# Altium schematic sheet Main PCB.SchDoc
size Legal
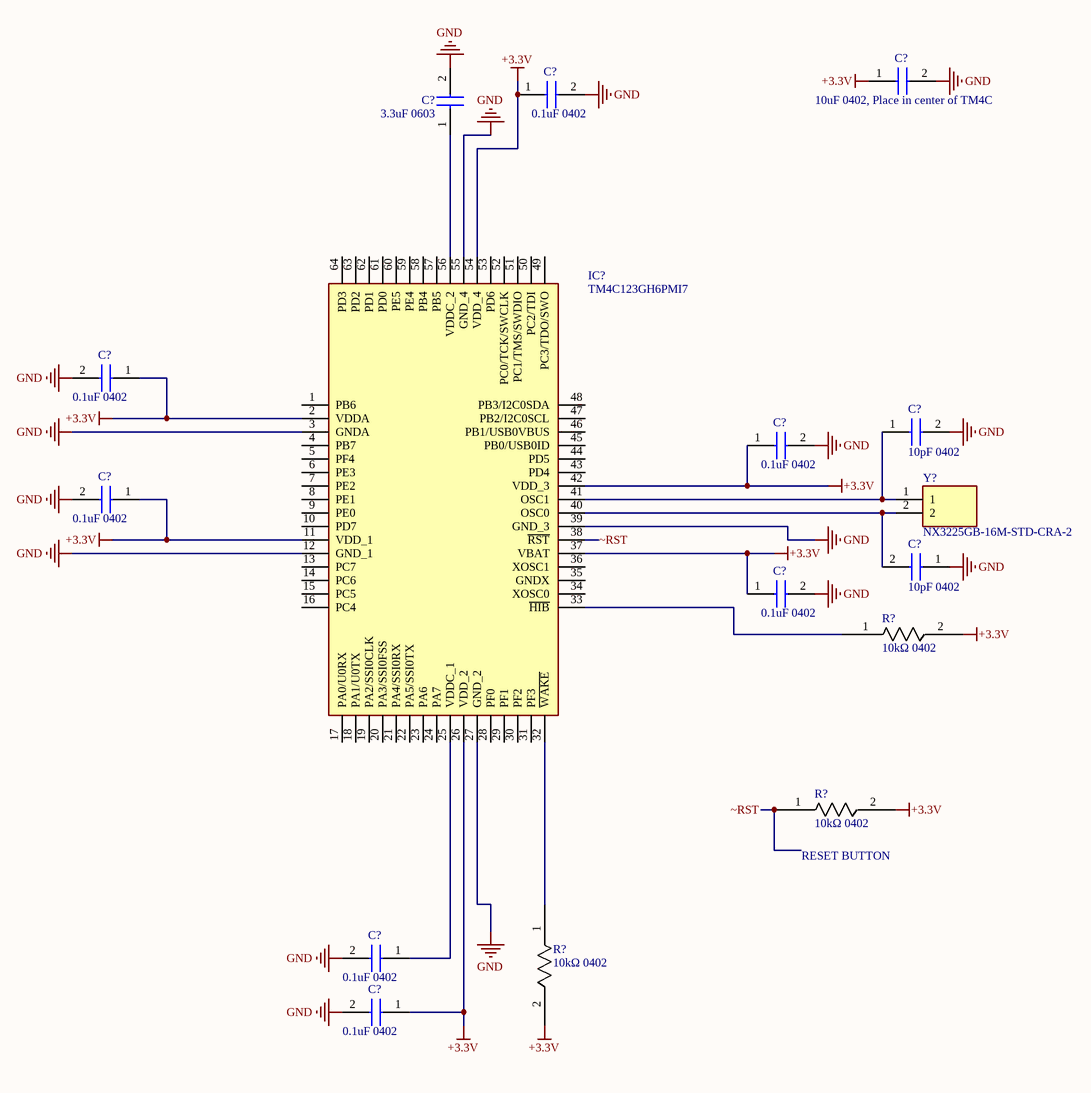
[diagram p0: Main PCB.SchDoc]

## Parts
(Parts that share a designator on the sheet are numbered #1, #2 ... from top to bottom, then left to right.)
C?#1  10uF 0402, Place in center of TM4C  [CAPC1005X56N]
C?#2  0.1uF 0402  [CAPC1005X56N]
C?#3  3.3uF 0603  [CAPC1005X56N]
C?#4  0.1uF 0402  [CAPC1005X56N]
C?#5  10pF 0402  [CAPC1005X56N]
C?#6  0.1uF 0402  [CAPC1005X56N]
C?#7  0.1uF 0402  [CAPC1005X56N]
C?#8  10pF 0402  [CAPC1005X56N]
C?#9  0.1uF 0402  [CAPC1005X56N]
C?#10  0.1uF 0402  [CAPC1005X56N]
C?#11  0.1uF 0402  [CAPC1005X56N]
IC?  TM4C123GH6PMI7  [QFP50P1200X1200X160-64N]
R?#1  10kΩ 0402  [0402]
R?#2  10kΩ 0402  [0402]
R?#3  10kΩ 0402  [0402]
Y?  NX3225GB-16M-STD-CRA-2  [NX3225GD-STD-CRA-3]

## Nets
+3.3V: C?#1.1 C?#2.1 C?#4.1 C?#6.1 C?#7.1 C?#9.1 C?#11.1 IC?.2(VDDA) IC?.11(VDD_1) IC?.26(VDD_2) IC?.37(VBAT) IC?.42(VDD_3) IC?.54(VDD_4)
GND: C?#1.2 C?#2.2 C?#3.2 C?#4.2 C?#5.2 C?#6.2 C?#7.2 C?#8.1 C?#9.2 C?#10.2 C?#11.2 IC?.3(GNDA) IC?.12(GND_1) IC?.27(GND_2) IC?.39(GND_3) IC?.55(GND_4)
~RST: IC?.38(~{RST}) R?#2.1
NetC?#3_1: C?#3.1 IC?.56(VDDC_2)
NetC?#5_1: C?#5.1 IC?.41(OSC1) Y?.1
NetC?#8_2: C?#8.2 IC?.40(OSC0) Y?.2
NetC?#10_1: C?#10.1 IC?.25(VDDC_1)
NetIC?_32: IC?.32(~{WAKE}) R?#3.1
NetIC?_33: IC?.33(~{HIB}) R?#1.1

Not connected (* = marked no-connect by the designer): IC? 1(PB6) 4(PB7) 5(PF4) 6(PE3) 7(PE2) 8(PE1) 9(PE0) 10(PD7) 13(PC7) 14(PC6) 15(PC5) 16(PC4) 17(PA0/U0RX) 18(PA1/U0TX) 19(PA2/SSI0CLK) 20(PA3/SSI0FSS) 21(PA4/SSI0RX) 22(PA5/SSI0TX) 23(PA6) 24(PA7) 28(PF0) 29(PF1) 30(PF2) 31(PF3) 34(XOSC0) 35(GNDX) 36(XOSC1) 43(PD4) 44(PD5) 45(PB0/USB0ID) 46(PB1/USB0VBUS) 47(PB2/I2C0SCL) 48(PB3/I2C0SDA) 49(PC3/TDO/SWO) 50(PC2/TDI) 51(PC1/TMS/SWDIO) 52(PC0/TCK/SWCLK) 53(PD6) 57(PB5) 58(PB4) 59(PE4) 60(PE5) 61(PD0) 62(PD1) 63(PD2) 64(PD3); R?#1 2; R?#2 2; R?#3 2

## Notes on the sheet
- (near R?#2) RESET BUTTON
- Labels drawn without touching a wire or pin: +3.3V

## Library data of the parts
C?#1 C?#2 C?#4-C?#11 = 04025A100BAT2A: Capacitor; Manufacturer_Name: AVX; Datasheet Link: http://www.mouser.com/catalog/supplier/library/pdf/AVXSurfaceMountCeramic.pdf; Height: 0.56mm; Manufacturer_Part_Number: 04025A100BAT2A; Arrow Part Number: 04025A100BAT2A; Arrow Price/Stock: https://www.arrow.com/en/products/04025a100bat2a/avx; Mouser Part Number: 581-04025A100B; Mouser Price/Stock: https://www.mouser.com/Search/Refine.aspx?Keyword=581-04025A100B
C?#3 = Capacitor, 0603: Manufacturer_Name: AVX; Manufacturer_Part_Number: 04025A100BAT2A; Datasheet Link: http://www.mouser.com/catalog/supplier/library/pdf/AVXSurfaceMountCeramic.pdf; Height: 0.56mm; Arrow Part Number: 04025A100BAT2A; Arrow Price/Stock: https://www.arrow.com/en/products/04025a100bat2a/avx; Mouser Part Number: 581-04025A100B; Mouser Price/Stock: https://www.mouser.com/Search/Refine.aspx?Keyword=581-04025A100B
IC? = TM4C123GH6PMI7: Integrated Circuit; Manufacturer_Name: Texas Instruments; Datasheet Link: http://www.ti.com/lit/gpn/tm4c123gh6pm; Height: 1.6mm; Manufacturer_Part_Number: TM4C123GH6PMI7; Arrow Part Number: TM4C123GH6PMI7; Arrow Price/Stock: https://www.arrow.com/en/products/tm4c123gh6pmi7/texas-instruments; Mouser Part Number: 595-TM4C123GH6PMI7; Mouser Price/Stock: https://www.mouser.co.uk/ProductDetail/Texas-Instruments/TM4C123GH6PMI7?qs=m%2F7bTylgptcEEuXHNU46tA%3D%3D
R?#1-R?#3 = Resistor, 0402
Y? = NX3225GB-16M-STD-CRA-2: Crystal or Oscillator; Manufacturer_Name: NDK; Datasheet Link: http://www.ndk.com/images/products/catalog/c_NX3225GB-STD-CRA-2_e.pdf; Manufacturer_Part_Number: NX3225GB-16M-STD-CRA-2; Mouser Part Number: 344-NX3225GB16MSTRA2; Mouser Price/Stock: https://www.mouser.co.uk/ProductDetail/NDK/NX3225GB-16M-STD-CRA-2?qs=w%2Fv1CP2dgqqz6Fo69dRGLg%3D%3D